# EAGLE schematic basic_circuit (EAGLE 9.6.2)
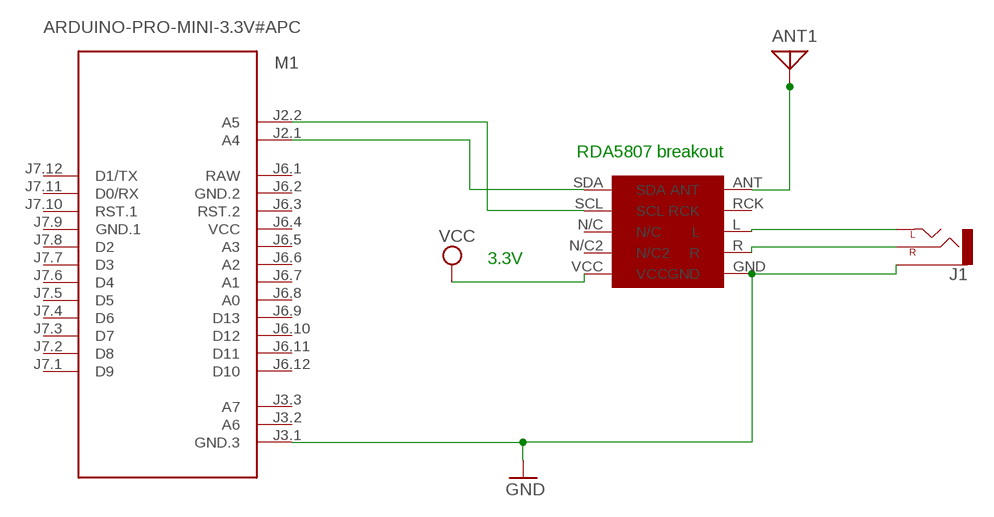
[diagram p0: schematic, sheet 1]

## Parts
ANT1  ANTENNA  [PAD-01]
J1  AUDIO_JACK_2.5MMSPECIAL_POGO_PINS  [STEREOJACK2.5MM_SPECIAL_POGOPINS]
M1  ARDUINO-PRO-MINI-3.3V#APC  [ARDUINO-PRO-MINI#APC]
U$1  RDA  [RDA]

## Nets
GND: J1.RING1(SLEEVE) M1.J3.1(GND.3) U$1.GND
N$1: M1.J2.1(A4) U$1.SDA
N$2: M1.J2.2(A5) U$1.SCL
N$3: J1.SHIELD(LEFT) U$1.L
N$5: J1.TIP(RIGHT) U$1.R
N$6: ANT1.1 U$1.ANT
VCC: U$1.VCC
Unconnected: M1.J3.2(A6) M1.J3.3(A7) M1.J6.3(RST.2) M1.J6.5(A3) M1.J6.6(A2) M1.J6.7(A1) M1.J6.8(A0) M1.J6.9(D13) M1.J6.10(D12) M1.J6.11(D11) M1.J6.12(D10) M1.J7.1(D9) M1.J7.2(D8) M1.J7.3(D7) M1.J7.4(D6) M1.J7.5(D5) M1.J7.6(D4) M1.J7.7(D3) M1.J7.8(D2) M1.J7.10(RST.1) M1.J7.11(D0/RX) M1.J7.12(D1/TX) U$1.N/C U$1.N/C2 U$1.RCK

## Notes on the sheet
- RDA5807 breakout
- 3.3V

## Power pins joined to a net without a drawn wire
GND.1: M1.J7.9(GND.1)
GND.2: M1.J6.2(GND.2)
RAW: M1.J6.1(RAW)
VCC: M1.J6.4(VCC)

## Library data of the parts
ANT1 = discrete:ANTENNA: Antenna
J1 = SparkFun-Connectors:AUDIO_JACK_2.5MM: Audio Jack 2.5mm variants of PTH and SMT audio jacks. SparkFun Products: SparkFun PicoBoard <https://www.sparkfun.com/products/11888>- 2.5mm SMD
M1 = diy-modules:ARDUINO-PRO-MINI-*#APC: Arduino Pro Mini (and compatible devices) with angle programming connector More details available here: https://www.arduino.cc/en/Main/ArduinoBoardProMini Click here to find device on ebay.com <http://www.ebay.com/sch/arduino+pro+mini>
U$1 = RDA:RDA